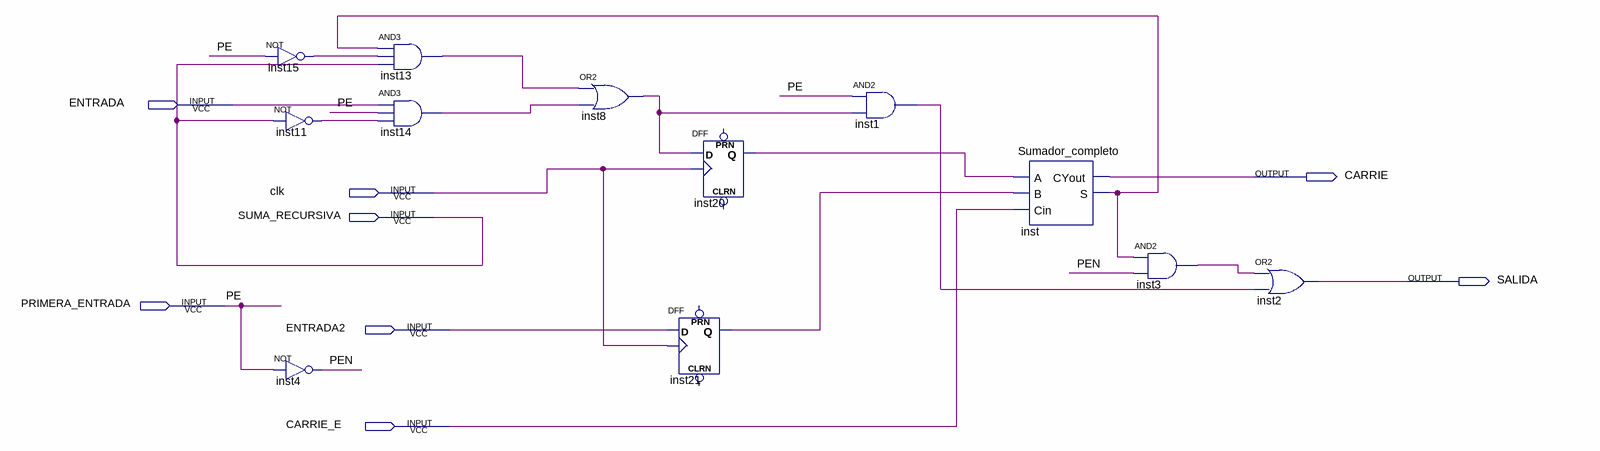
[diagram p0: schematic sheet]
// Quartus schematic PRUEBA_SUMADOR_RECURSIVO.bdf as structural Verilog: 12 symbols, 8 pins
module PRUEBA_SUMADOR_RECURSIVO (
  input  ENTRADA,
  input  clk,
  input  SUMA_RECURSIVA,
  input  PRIMERA_ENTRADA,
  input  ENTRADA2,
  input  CARRIE_E,
  output CARRIE,
  output SALIDA
);

  wire inst1_out, inst3_out, inst8_out, inst11_out, inst13_out, inst14_out, inst15_out, inst20_q, inst21_q,
       inst_s, PEN;

  not inst15 (inst15_out, PRIMERA_ENTRADA);
  not inst11 (inst11_out, SUMA_RECURSIVA);
  not inst4 (PEN, PRIMERA_ENTRADA);
  and inst13 (inst13_out, inst_s, inst15_out, SUMA_RECURSIVA);
  and inst14 (inst14_out, ENTRADA, PRIMERA_ENTRADA, inst11_out);
  or inst8 (inst8_out, inst13_out, inst14_out);
  DFF inst21 (.CLK(clk), .D(ENTRADA2), .Q(inst21_q));  // open: CLRN, PRN
  DFF inst20 (.CLK(clk), .D(inst8_out), .Q(inst20_q));  // open: CLRN, PRN
  and inst1 (inst1_out, PRIMERA_ENTRADA, inst8_out);
  Sumador_completo inst (.A(inst20_q), .B(inst21_q), .Cin(CARRIE_E), .CYout(CARRIE), .S(inst_s));
  and inst3 (inst3_out, inst_s, PEN);
  or inst2 (SALIDA, inst3_out, inst1_out);

  // Other names for the same wires on the sheet: PE = PRIMERA_ENTRADA
endmodule
